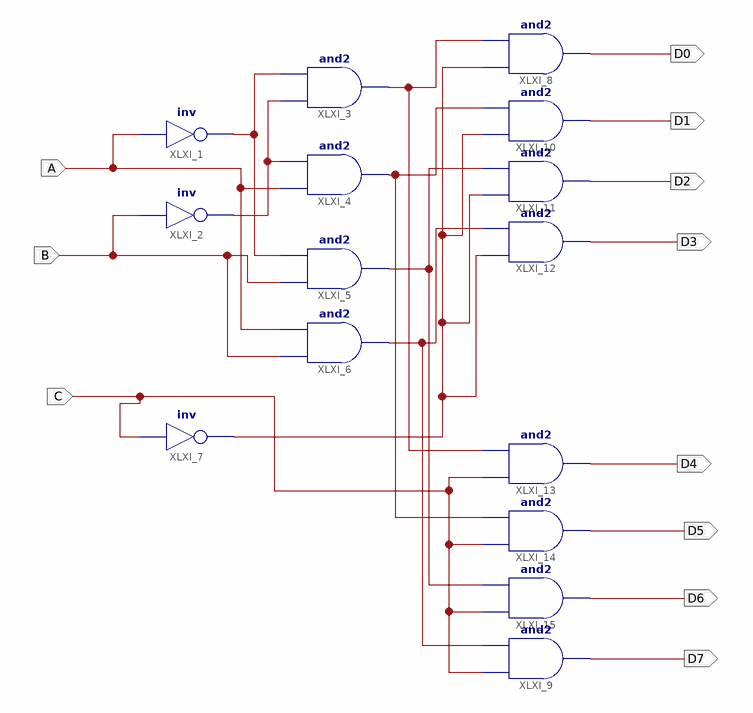
[diagram p0: schematic sheet 1]
// Xilinx ISE schematic Decoder_38_sch.sch (kintex7) as structural Verilog: 15 symbols, 11 ports
module Decoder_38_sch (
  input  A,
  input  B,
  input  C,
  output D0,
  output D1,
  output D2,
  output D3,
  output D4,
  output D5,
  output D6,
  output D7
);

  wire XLXN_6, XLXN_10, XLXN_16, XLXN_24, XLXN_26, XLXN_27, XLXN_28;

  not XLXI_1 (XLXN_6, A);
  not XLXI_2 (XLXN_10, B);
  and XLXI_3 (XLXN_26, XLXN_10, XLXN_6);
  and XLXI_4 (XLXN_27, A, XLXN_10);
  and XLXI_5 (XLXN_24, B, XLXN_6);
  and XLXI_6 (XLXN_28, B, A);
  not XLXI_7 (XLXN_16, C);
  and XLXI_8 (D0, XLXN_16, XLXN_26);
  and XLXI_9 (D7, C, XLXN_28);
  and XLXI_10 (D1, XLXN_16, XLXN_27);
  and XLXI_11 (D2, XLXN_16, XLXN_24);
  and XLXI_12 (D3, XLXN_16, XLXN_28);
  and XLXI_13 (D4, C, XLXN_26);
  and XLXI_14 (D5, C, XLXN_27);
  and XLXI_15 (D6, C, XLXN_24);
endmodule
